# Altium schematic sheet 数控936 电源部分.SchDoc
size A4
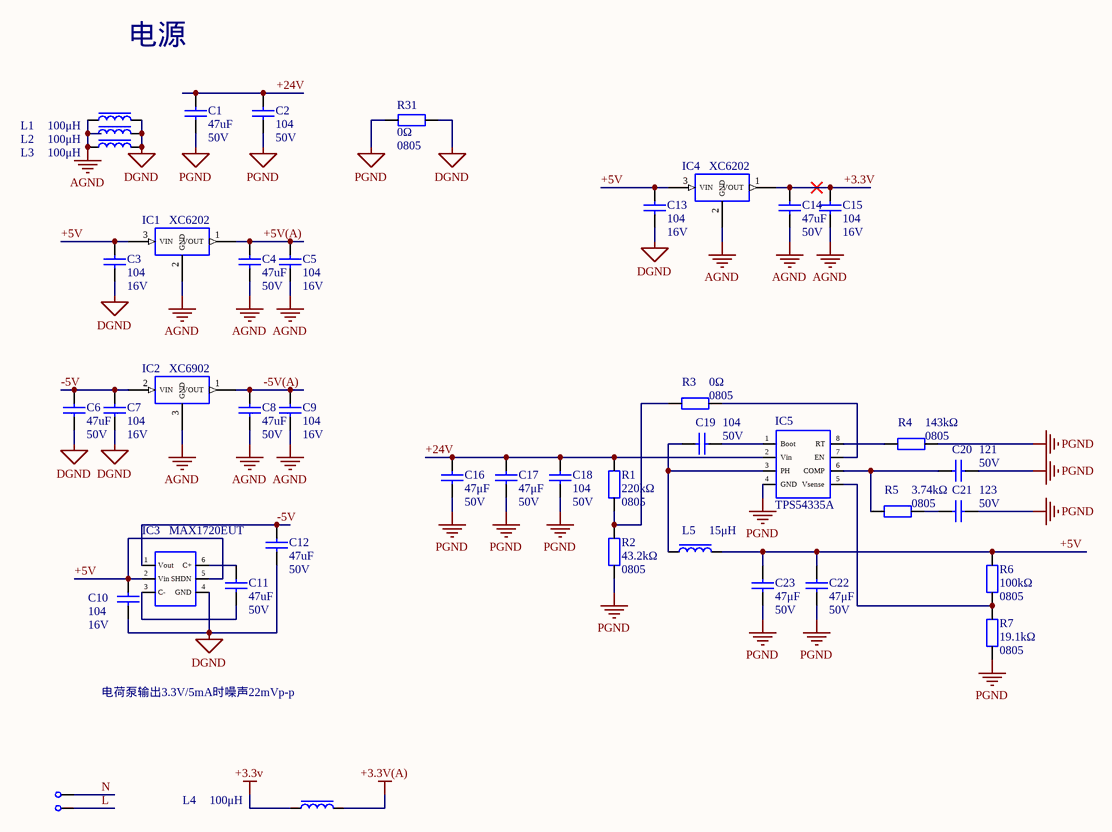
[diagram p0: 数控936 电源部分.SchDoc]

## Parts
1  point  [point]  (value not drawn)
2  point  [point]  (value not drawn)
C1  47uF  value 50V  [C1210]
C2  104  value 50V  [C0805]
C3  104  value 16V  [C0805]
C4  47uF  value 50V  [C1210]
C5  104  value 16V  [C0805]
C6  47uF  value 50V  [C1210]
C7  104  value 16V  [C0805]
C8  47uF  value 50V  [C1210]
C9  104  value 16V  [C0805]
C10  104  value 16V  [C0805]
C11  47uF  value 50V  [C1210]
C12  47uF  value 50V  [C1210]
C13  104  value 16V  [C0805]
C14  47uF  value 50V  [C1210]
C15  104  value 16V  [C0805]
C16  47μF  value 50V  [C1210]
C17  47μF  value 50V  [C1210]
C18  104  value 50V  [C0805]
C19  104  value 50V  [C0805]
C20  121  value 50V  [C0805]
C21  123  value 50V  [C0805]
C22  47μF  value 50V  [C1210]
C23  47μF  value 50V  [C1210]
IC1  XC6202  [SOT-89]
IC2  XC6902  [SOT-89]
IC3  MAX1720EUT  [TSOP-6]
IC4  XC6202  [SOT-89]
IC5  TPS54335A  [SOP-8(体宽3.8mm,底部焊盘)]
L1  100μH  [R0805]
L2  100μH  [R0805]
L3  100μH  [R0805]
L4  100μH  [R0805]
L5  15μH  [L0420]
R1  220kΩ  value 0805  [R0805]
R2  43.2kΩ  value 0805  [R0805]
R3  0Ω  value 0805  [R0805]
R4  143kΩ  value 0805  [R0805]
R5  3.74kΩ  value 0805  [R0805]
R6  100kΩ  value 0805  [R0805]
R7  19.1kΩ  value 0805  [R0805]
R31  0Ω  value 0805  [R0805]

## Nets
+3.3V: C14.2 C15.2 IC4.1(VOUT) L4.2
+3.3V(A): L4.1
AGND: C4.1 C5.1 C8.1 C9.1 C14.1 C15.1 IC1.2(GND) IC2.3(GND) IC4.2(GND) L1.2 L2.2 L3.2
DGND: C3.1 C6.1 C7.1 C10.1 C12.1 C13.1 IC3.4(GND) L1.1 L2.1 L3.1 R31.2
PGND: C1.1 C2.1 C16.1 C17.1 C18.1 C20.1 C21.1 C22.1 C23.1 IC5.4(GND) R2.1 R4.2 R7.1 R31.1
+5V: C3.2 C10.2 C13.2 C22.2 C23.2 IC1.3(VIN) IC3.2(Vin) IC3.5(SHDN) IC4.3(VIN) L5.1 R6.2
+5V(A): C4.2 C5.2 IC1.1(VOUT)
+24V: C1.2 C2.2 C16.2 C17.2 C18.2 IC5.2(Vin) R1.2
-5V: C6.2 C7.2 C12.2 IC2.2(VIN) IC3.1(Vout)
-5V(A): C8.2 C9.2 IC2.1(VOUT)
L: 2.1
N: 1.1
NetC11_1: C11.1 IC3.3(C-)
NetC11_2: C11.2 IC3.6(C+)
NetC19_1: C19.1 IC5.3(PH) L5.2
NetC19_2: C19.2 IC5.1(Boot)
NetC20_2: C20.2 IC5.6(COMP) R5.2
NetC21_2: C21.2 R5.1
NetIC5_5: IC5.5(Vsense) R6.1 R7.2
NetIC5_7: IC5.7(EN) R3.2
NetIC5_8: IC5.8(RT) R4.1
NetR1_1: R1.1 R2.2 R3.1

## Notes on the sheet
- 电源
- 电荷泵输出3.3V/5mA时噪声22mVp-p

## Library data of the parts
1 2 = point: 焊盘
C1-C23 = 104: 无极性电容
IC1 IC2 IC4 = AMS1117-3.3: LDO
IC3 = MAX1720EUT: 负压电荷泵
IC5 = TPS54335A: buck型电源管理
L1-L5 = 470mH: 电感
R1-R7 R31 = 10kΩ: 贴片/直插电阻